# EAGLE design mapleSDuino-V0.1_020-eagle7 (EAGLE 7.6.0)
MAPLE-CUx Large Version
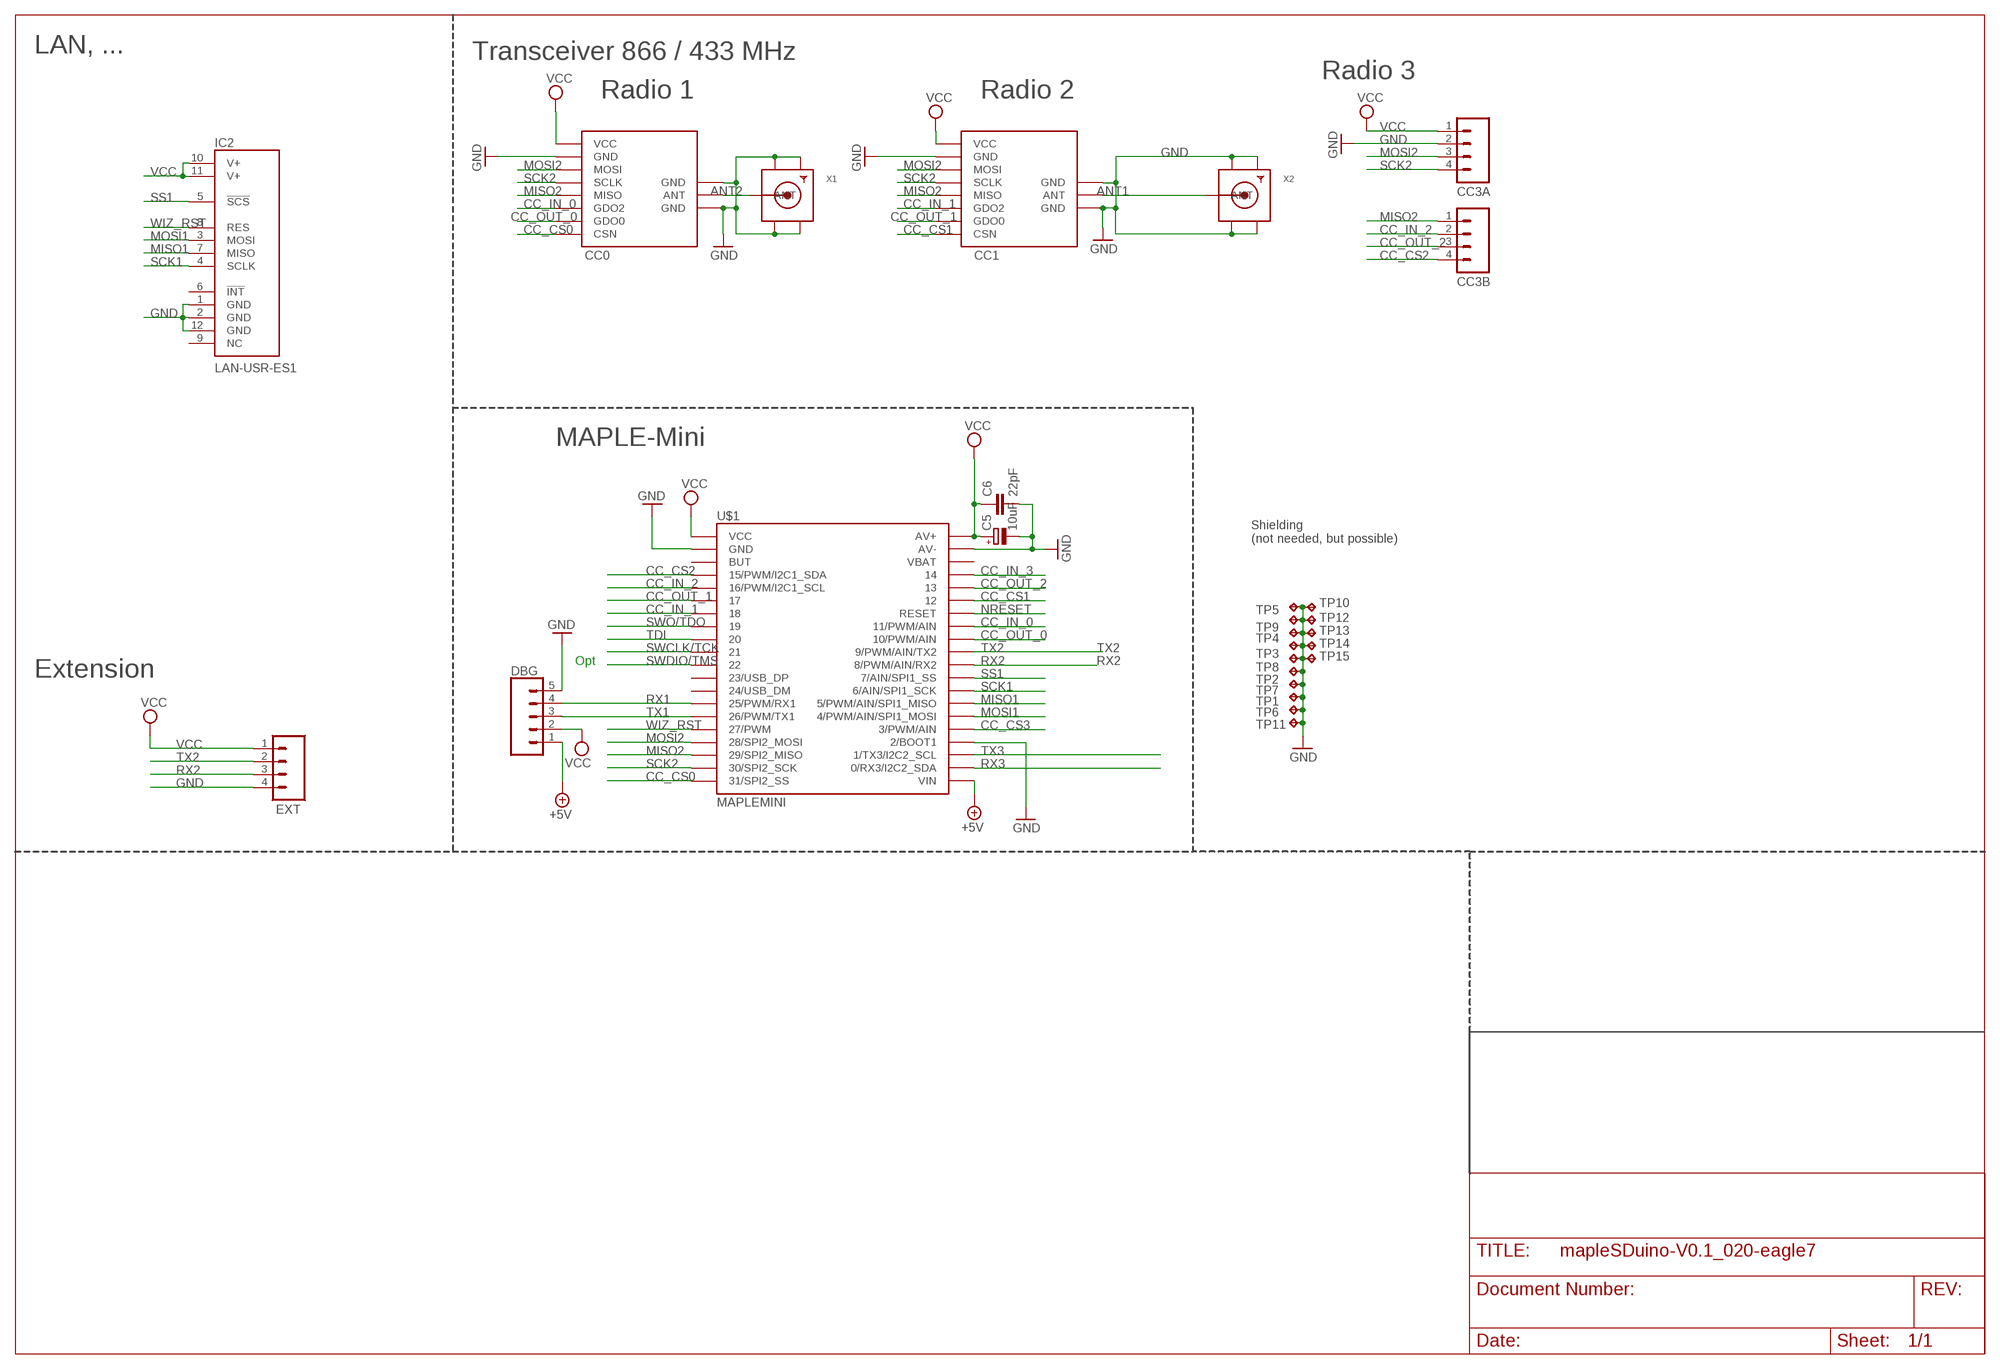
[diagram p0: schematic, sheet 1]

## Parts
C5  10uF  CPOL-EUR/2012-12W  [R/2012-12W]
C6  22pF  C-EUC0805  [C0805]
CC0  CC1101  CC1101_MODULE1SMD  [CC1101_MODULE1_SMD]
CC1  CC1101_MODULE1SMD  [CC1101_MODULE1_SMD]
CC3A  CONN_04PTH  [1X04]
CC3B  CONN_04PTH  [1X04]
DBG  CONN_05LOCK  [1X05_LOCK]
EXT  CONN_04PTH  [1X04]
IC2  LAN-USR-ES1  [USR-ES1]
TP1  TPTP06SQ  [TP06SQ]
TP2  TPTP06SQ  [TP06SQ]
TP3  TPTP06SQ  [TP06SQ]
TP4  TPTP06SQ  [TP06SQ]
TP5  TPTP06SQ  [TP06SQ]
TP6  TPTP06SQ  [TP06SQ]
TP7  TPTP06SQ  [TP06SQ]
TP8  TPTP06SQ  [TP06SQ]
TP9  TPTP06SQ  [TP06SQ]
TP10  TPTP06SQ  [TP06SQ]
TP11  TPTP06SQ  [TP06SQ]
TP12  TPTP06SQ  [TP06SQ]
TP13  TPTP06SQ  [TP06SQ]
TP14  TPTP06SQ  [TP06SQ]
TP15  TPTP06SQ  [TP06SQ]
U$1  MAPLEMINI  [20-DIP]
X1  SMACONNECTOR_EDGE  [SMA_EDGELAUNCH]
X2  SMACONNECTOR_EDGE  [SMA_EDGELAUNCH]

## Nets
+5V [PWR]: DBG.1 U$1.21(VIN)
ANT1 [PWR]: CC1.ANT X2.P(ANT)
ANT2: CC0.ANT X1.P(ANT)
CC_CS0: CC0.CSN U$1.20(31/SPI2_SS)
CC_CS1: CC1.CSN U$1.35
CC_CS2: CC3B.4 U$1.4(15/PWM/I2C1_SDA)
CC_CS3: U$1.25(3/PWM/AIN)
CC_IN_0: CC0.GDO2 U$1.33(11/PWM/AIN)
CC_IN_1: CC1.GDO2 U$1.7
CC_IN_2: CC3B.2 U$1.5(16/PWM/I2C1_SCL)
CC_IN_3: U$1.37
CC_OUT_0: CC0.GDO0 U$1.32(10/PWM/AIN)
CC_OUT_1: CC1.GDO0 U$1.6
CC_OUT_2: CC3B.3 U$1.36
GND [PWR]: C5.- C6.2 CC0.GND@0(GND) CC0.GND@1(GND) CC0.GND@2(GND) CC1.GND@0(GND) CC1.GND@1(GND) CC1.GND@2(GND) CC3A.2 DBG.5 EXT.4 IC2.1(GND) IC2.2(GND) IC2.12(GND) TP1.TP TP2.TP TP3.TP TP4.TP TP5.TP TP6.TP TP7.TP TP8.TP TP9.TP TP10.TP TP11.TP TP12.TP TP13.TP TP14.TP TP15.TP U$1.2(GND) U$1.24(2/BOOT1) U$1.39(AV-) X1.GND@1(GND4) X1.GND@2(GND3) X1.GND@3(GND2) X1.GND@4(GND1) X2.GND@1(GND4) X2.GND@2(GND3) X2.GND@3(GND2) X2.GND@4(GND1)
MISO1: IC2.7(MISO) U$1.27(5/PWM/AIN/SPI1_MISO)
MISO2: CC0.MISO CC1.MISO CC3B.1 U$1.18(29/SPI2_MISO)
MOSI1: IC2.3(MOSI) U$1.26(4/PWM/AIN/SPI1_MOSI)
MOSI2: CC0.MOSI CC1.MOSI CC3A.3 U$1.17(28/SPI2_MOSI)
NRESET: U$1.34(RESET)
RX1: DBG.4 U$1.14(25/PWM/RX1)
RX2: EXT.3 U$1.30(8/PWM/AIN/RX2)
RX3: U$1.22(0/RX3/I2C2_SDA)
SCK1: IC2.4(SCLK) U$1.28(6/AIN/SPI1_SCK)
SCK2: CC0.SCLK CC1.SCLK CC3A.4 U$1.19(30/SPI2_SCK)
SS1: IC2.5(!SCS!) U$1.29(7/AIN/SPI1_SS)
SWCLK/TCK: U$1.10
SWDIO/TMS: U$1.11
SWO/TDO: U$1.8
TDI: U$1.9
TX1: DBG.3 U$1.15(26/PWM/TX1)
TX2: EXT.2 U$1.31(9/PWM/AIN/TX2)
TX3: U$1.23(1/TX3/I2C2_SCL)
VCC [PWR]: C5.+ C6.1 CC0.VCC CC1.VCC CC3A.1 DBG.2 EXT.1 IC2.10(V+) IC2.11(V+) U$1.1(VCC) U$1.40(AV+)
WIZ_RST: IC2.8(RES) U$1.16(27/PWM)
Unconnected: IC2.6(!INT!) IC2.9(NC) U$1.3(BUT) U$1.12(23/USB_DP) U$1.13(24/USB_DM) U$1.38(VBAT)

## Notes on the sheet
- LAN, ... | Transceiver 866 / 433 MHz
- Radio 3
- Radio 1 | Radio 2
- MAPLE-Mini
- Shielding
  (not needed, but possible)
- Opt
- Extension

## Library data of the parts
C5 = rcl:CPOL-EU: POLARIZED CAPACITOR, European symbol
C6 = rcl:C-EU: CAPACITOR, European symbol
CC0 CC1 = wireless:CC1101_MODULE1: CC1101 wireless module for 433/868 MHz (sold from Aliexpress). DIL version for mounting with pin header (and SMD soldering) and SMD only variant available.
CC3A CC3B EXT = SparkFun-Connectors:CONN_04: Multi connection point. Often used as Generic Header-pin footprint for 0.1 inch spaced/style header connections On any of the 0.1 inch spaced packages, you can populate with these: Break Away Headers - Straight <https://www.sparkfun.com/products/116> (PRT-00116) Break Away Male Headers - Right Angle <https://www.sparkfun.com/products/553> (PRT-00553) Female Headers <https://www.sparkfun.com/products/115> (PRT-00115) Break Away Headers - Machine Pin <https://www.sparkfun.com/products/117> (PRT-00117) Break Away Female Headers - Swiss Machine Pin <https://www.sparkfun.com/products/743> (PRT-00743) For SCREWTERMINALS and SPRING TERMINALS visit here: Screw Terimnals on SparkFun.com <https://www.sparkfun.com/search/results?term=Screw+Terminals> (5mm/3.5mm/2.54mm spacing) This device is also useful as a general connection point to wire up your design to another part of your project. Our various solder wires solder well into these plated through hole pads. Hook-Up Wire - Assortment (Stranded, 22 AWG) <https://www.sparkfun.com/products/11375> (PRT-11375) Hook-Up Wire - Assortment (Solid Core, 22 AWG) <https://www.sparkfun.com/products/11367> (PRT-11367) View the entire wire category on our website here <https://www.sparkfun.com/categories/141> Special notes: Molex polarized connector foot print use with SKU : PRT-08231 with associated crimp pins and housings. 1MM SMD Version SKU: PRT-10208; PROD_ID: CONN-09696
DBG = SparkFun-Connectors:CONN_05: Multi connection point. Often used as Generic Header-pin footprint for 0.1 inch spaced/style header connections On any of the 0.1 inch spaced packages, you can populate with these: Break Away Headers - Straight <https://www.sparkfun.com/products/116> (PRT-00116) Break Away Male Headers - Right Angle <https://www.sparkfun.com/products/553> (PRT-00553) Female Headers <https://www.sparkfun.com/products/115> (PRT-00115) Break Away Headers - Machine Pin <https://www.sparkfun.com/products/117> (PRT-00117) Break Away Female Headers - Swiss Machine Pin <https://www.sparkfun.com/products/743> (PRT-00743) For SCREWTERMINALS and SPRING TERMINALS visit here: Screw Terimnals on SparkFun.com <https://www.sparkfun.com/search/results?term=Screw+Terminals> (5mm/3.5mm/2.54mm spacing) This device is also useful as a general connection point to wire up your design to another part of your project. Our various solder wires solder well into these plated through hole pads. Hook-Up Wire - Assortment (Stranded, 22 AWG) <https://www.sparkfun.com/products/11375> (PRT-11375) Hook-Up Wire - Assortment (Solid Core, 22 AWG) <https://www.sparkfun.com/products/11367> (PRT-11367) View the entire wire category on our website here <https://www.sparkfun.com/categories/141> Special notes: Molex polarized connector foot print use with SKU : PRT-08231 with associated crimp pins and housings. 1MM SMD Version SKU: PRT-10208
IC2 = Martin-Communication:LAN-USR-ES1
TP1-TP15 = testpad:TP: Test pad
U$1 = maplemini-small:MAPLEMINI
X1 X2 = adafruit:SMACONNECTOR: SMA Connector 90° DIP SMA Connector, 50 Ohm (4UConnector: 07259)

## Net classes
0 default: width 0.305 mm
1 PWR: width 0.406 mm

## Board
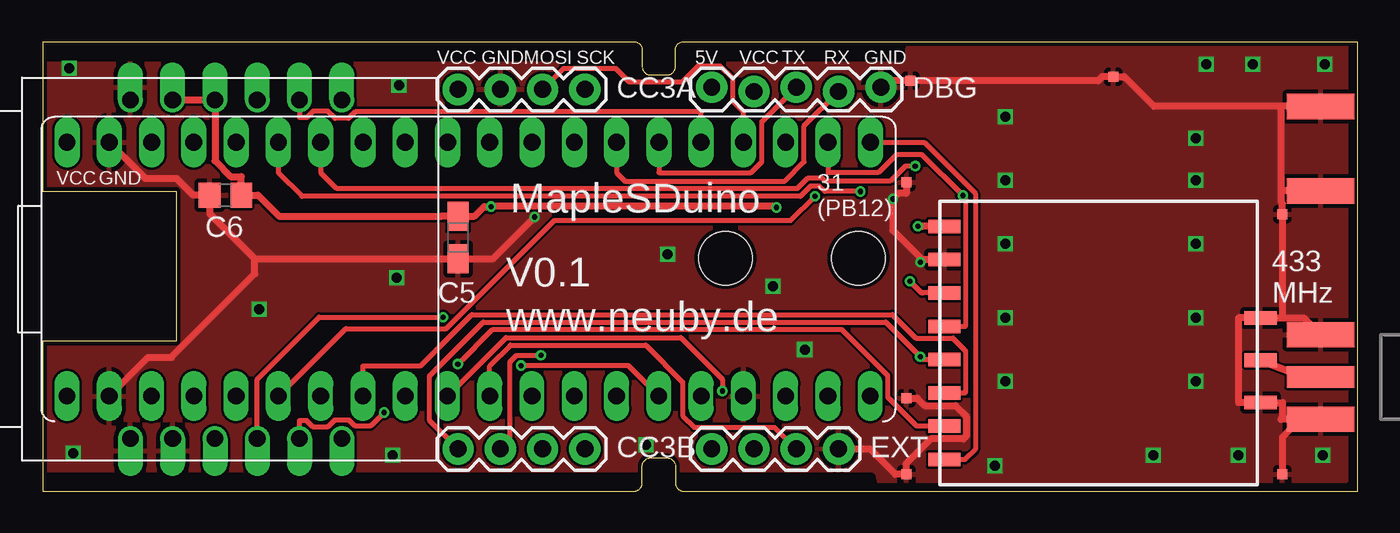
[diagram p1: board, top side]
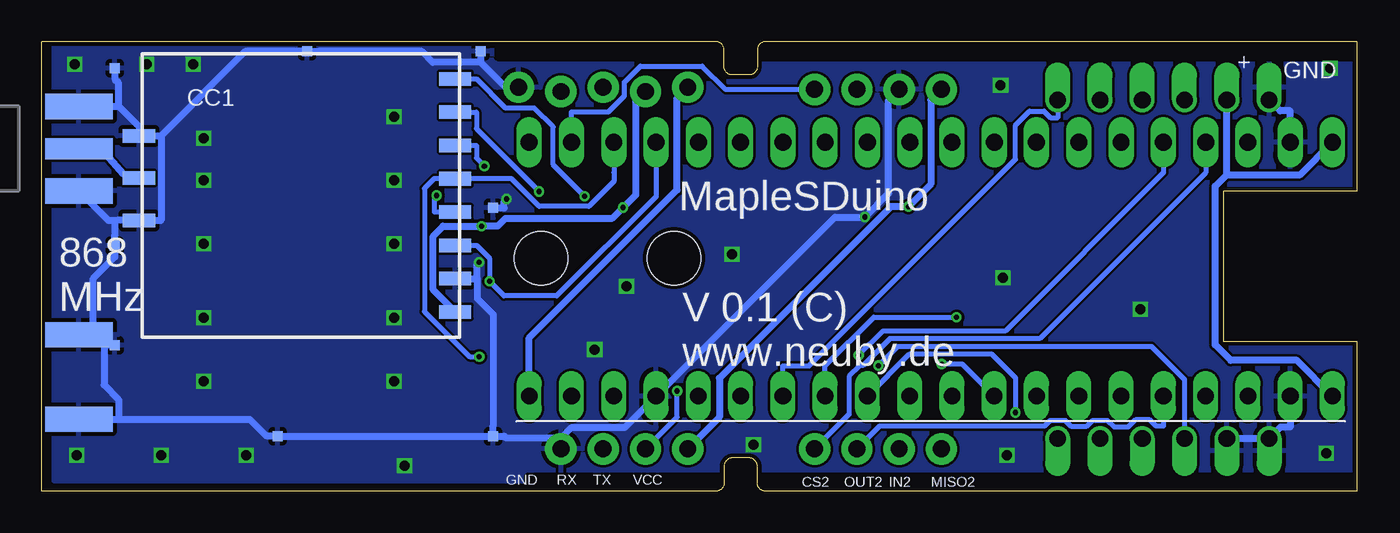
[diagram p2: board, bottom side, seen from below]

Size 79 x 27 mm. Coordinates in mm from the lower left corner, seen from the top.
Outline: 0,0 35.5,0 arc90 36,0.5 36,1.5 arc-90 36.5,2 37.5,2 arc-90 38,1.5 38,0.5 arc90 38.5,0 79,0 79,27 38.5,27 arc90 38,26.5 38,25.5 arc-90 37.5,25 36.5,25 arc-90 36,25.5 36,26.5 arc90 35.5,27 0,27 0,18 8,18 8,9 0,9 0,0
Copper layers (1*16): Top 0.035mm / dielectric 1.5mm / Bottom 0.035mm
Design rules "Fusion_eagle_rule_v1.1": minimum track width 6mil, minimum drill 12mil, track to track 6mil, track to pad 6mil, pad to pad 6mil, via to via 6mil, smd to smd 0mil, copper to edge 10mil, drill to drill 10mil, minimum pad ring 10mil, minimum via ring 6mil, stop-mask expansion 2mil, vias tented up to drill 100mil, thermal gap 10mil
Holes 3.2 mm at 49,14 41,14
tRestrict: 8 lines
bRestrict: 8 lines

### Footprints (pad centres in the part's own frame; a part is rotated, then mirrored left to right if it is on the bottom)
R/2012-12W = smd 1.75 x 1.26: + 1.275,0; - -1.275,0
C0805 = smd 1.3 x 1.5: 1 -0.95,0; 2 0.95,0
CC1101_MODULE1_SMD = smd 1.93 x 0.813: ANT 19,5.96; CSN 0,0; GDO0 0,2; GDO2 0,4; GND@0 0,12; GND@1 19,8.5; GND@2 19,3.42; MISO 0,6; MOSI 0,10; SCLK 0,8; VCC 0,14
1X04 = drill 1.016 pad 1.88: 1 0,0; 2 2.54,0; 3 5.08,0; 4 7.62,0
1X05_LOCK = drill 1.016 pad 1.88: 1 0,0.127; 2 2.54,-0.127; 3 5.08,0.127; 4 7.62,-0.127; 5 10.16,0.127
USR-ES1 = drill 1 pad 1.35 offset: 1 -10.16,5.715; 2 -10.16,3.175; 3 -10.16,0.635; 4 -10.16,-1.905; 5 -10.16,-4.445; 6 -10.16,-6.985; 7 10.16,-6.985; 8 10.16,-4.445; 9 10.16,-1.905; 10 10.16,0.635; 11 10.16,3.175; 12 10.16,5.715
TP06SQ = smd 0.6 x 0.6: TP 0,0
20-DIP = drill 1.016 pad 1.27 long: 1 -24.13,-7.62; 2 -21.59,-7.62; 3 -19.05,-7.62; 4 -16.51,-7.62; 5 -13.97,-7.62; 6 -11.43,-7.62; 7 -8.89,-7.62; 8 -6.35,-7.62; 9 -3.81,-7.62; 10 -1.27,-7.62; 11 1.27,-7.62; 12 3.81,-7.62; 13 6.35,-7.62; 14 8.89,-7.62; 15 11.43,-7.62; 16 13.97,-7.62; 17 16.51,-7.62; 18 19.05,-7.62; 19 21.59,-7.62; 20 24.13,-7.62 | drill 1 pad 1.27 long: 21 24.13,7.62; 22 21.59,7.62; 23 19.05,7.62; 24 16.51,7.62; 25 13.97,7.62; 26 11.43,7.62; 27 8.89,7.62; 28 6.35,7.62; 29 3.81,7.62; 30 1.27,7.62; 31 -1.27,7.62; 32 -3.81,7.62; 33 -6.35,7.62; 34 -8.89,7.62; 35 -11.43,7.62; 36 -13.97,7.62; 37 -16.51,7.62; 38 -19.05,7.62; 39 -21.59,7.62; 40 -24.13,7.62
SMA_EDGELAUNCH = smd 4.064 x 1.524: GND@1 2.032,-2.54; GND@2 2.032,2.54 | smd 4.064 x 1.524 bottom: GND@3 2.032,2.54; GND@4 2.032,-2.54 | smd 4.064 x 1.27: P 2.032,0

### Placement (x,y rotation side)
C5  24.94,15.24 90 top
C6  10.97,17.78 180 top
CC0  54.15,1.91 0 top
CC1  54.15,24.77 180 bottom
CC3A  24.94,24.13 0 top
CC3B  24.94,2.54 0 top
DBG  40.18,24.13 0 top
EXT  40.18,2.54 0 top
IC2  10.97,13.34 90 top
TP1  51.86,1.02 0 top
TP2  51.86,5.59 0 top
TP3  51.86,18.54 90 top
TP4  74.47,1.02 90 top
TP5  74.47,16.64 90 top
TP6  51.86,3.3 90 bottom
TP7  74.6,25.4 90 bottom
TP8  74.6,8.76 90 bottom
TP9  63.04,26.42 90 bottom
TP10  74.6,14.73 90 bottom
TP11  51.86,17.02 90 bottom
TP12  52.12,24.64 0 top
TP13  64.31,24.89 0 top
TP14  64.82,3.3 0 bottom
TP15  52.63,26.42 0 bottom
U$1  25.57,13.34 180 bottom
X1  78.79,6.86 180 top
X2  78.79,20.57 0 bottom

### Tracks (layer width: path | path; a pad name or v marks a point on that pad's centre or on a via)
+5V
  Bottom 0.406: U$1.21 49.7,9.2 40.81,18.09 40.81,23.62 DBG.1
ANT1
  Bottom 0.406: CC1.ANT 74.09,19.05 75.11,20.19 X2.P
ANT2
  Top 0.406: CC0.ANT 76.12,6.73 X1.P
CC_CS0
  Top 0.305: CC0.CSN 55.42,1.91 56.01,2.5 56.01,17.89 52.95,20.95 U$1.20
CC_CS1  (via drill 0.3 pad 0.61)
  Top 0.305: U$1.35 18.19,9.76 24.23,9.76 30.73,16.26 44.92,16.26 | 44.92,16.26 | 44.92,16.26 v46.38,17.72
  Bottom 0.305: CC1.CSN 52.88,24.77 51.13,23.01 49.41,23.01 48.27,21.88 48.27,19.61 v46.38,17.72
CC_CS2
  Bottom 0.305: CC3B.4 30.49,4.61 30.49,6.89 29.84,7.55 29.66,7.55 28.05,9.16 19.03,9.16 9.06,19.13 U$1.4
CC_IN_0
  Top 0.305: CC0.GDO2 55.42,5.91 55.42,8.45 54.67,9.19 52.45,9.19 51.04,10.61 25.77,10.61 22.69,7.53 19.23,7.53 U$1.33
CC_IN_1  (via drill 0.3 pad 0.61)
  Top 0.305: v52.4,19.53 51.82,19.53 50.91,18.62 46.98,18.62 46.82,18.79 45.94,18.79 45.31,18.16 17.65,18.16 16.68,19.13 U$1.7
  Bottom 0.305: CC1.GDO2 52.88,20.77 52.88,20 v52.4,19.53
CC_IN_2  (via drill 0.3 pad 0.61)
  Top 0.305: CC3B.2 28.06,3.12 28.06,7.77 28.45,8.16 v29.91,8.16
  Bottom 0.305: v29.91,8.16 28.45,9.62 21.11,9.62 11.61,19.13 U$1.5
CC_OUT_0  (via drill 0.3 pad 0.61)
  Top 0.305: CC0.GDO0 52.5,3.9 50.76,5.64 50.76,6.94 48.02,9.69 26.98,9.69 v24.93,7.63
  Bottom 0.305: U$1.32 23.68,7.63 v24.93,7.63
CC_OUT_1  (via drill 0.3 pad 0.61)
  Top 0.305: v49.11,18 46.96,18 46.63,18.33 46.13,18.33 45.5,17.71 15.56,17.71 14.14,19.13 U$1.6
  Bottom 0.305: v49.11,18 52.88,21.77 52.88,22.77 CC1.GDO0
CC_OUT_2
  Bottom 0.305: U$1.36 11.61,3.9 12.04,3.9 12.43,4.29 13.29,4.29 13.73,3.85 14.56,3.85 14.96,4.25 15.87,4.25 16.24,3.88 17.13,3.88 17.49,4.24 18.42,4.24 18.76,3.9 28.66,3.9 CC3B.3
GND  (via drill 0.3 pad 0.61, 0.6)
  Top 0.406: v29.54,16.47 27.04,13.96 C5.- 12.73,13.96 | v52.71,13.76 52.83,13.87 52.83,13.9 | 52.83,13.9 51.07,15.67 v51.07,17.55 51.4,17.89 51.86,17.89 TP3.TP | CC0.GND@0 52.83,13.9 | 74.37,23.11 66.74,23.11 64.97,24.89 TP13.TP 63.65,24.89 63.4,24.64 TP12.TP 50.72,24.64 DBG.5 | 74.37,23.11 75.56,23.11 X2.GND@2 | 74.37,23.11 74.37,18.03 | X2.GND@1 74.37,18.03 | 74.37,18.03 74.37,17.39 74.47,17.29 TP5.TP 74.47,15.98 74.47,10.4 | 74.47,10.4 75.75,10.4 X1.GND@1 | 74.47,10.4 CC0.GND@1 71.83,10.4 71.83,5.33 CC0.GND@2 74.47,5.33 74.47,4.42 74.37,4.32 75.56,4.32 | 12.73,13.96 10.02,16.67 C6.2 9.01,17.78 8.01,18.79 6.15,18.79 U$1.2 | U$1.39 6.31,8.04 7.72,8.04 12.73,13.06 12.73,13.96 | 75.56,4.32 74.47,3.23 TP4.TP | X1.GND@2 75.56,4.32 | TP2.TP 52.52,5.59 52.97,5.14 54.83,5.14 55.47,4.5 55.47,3.31 55.3,3.14 53.34,3.14 51.86,1.67 TP1.TP 51.21,1.02 49.68,2.54 EXT.4
  Bottom 0.406: CC3A.2 28.11,23.5 28.11,17.89 v29.54,16.47 31.33,16.47 U$1.24 43.96,3.84 47.15,3.84 47.8,3.19 | 52.85,12.77 52.85,13.62 v52.71,13.76 | 52.85,12.77 52.83,12.77 52.83,11.59 51.86,10.62 51.86,3.96 TP6.TP | 52.85,12.77 52.86,12.77 52.97,12.77 CC1.GND@0 | TP11.TP 51.21,17.02 51.21,17.41 v51.07,17.55 | 74.37,4.32 66.49,4.32 65.47,3.3 TP14.TP TP6.TP | 75.25,8.76 75.25,6.39 74.37,5.5 74.37,4.32 | 47.8,3.19 51.09,3.19 51.21,3.3 TP6.TP | EXT.4 47.8,3.19 | 75.89,9.4 75.25,8.76 | X1.GND@2 74.37,4.32 | 52.63,25.76 55.5,25.76 56.15,26.42 62.39,26.42 TP9.TP 66.76,26.42 71.83,21.34 | TP15.TP 52.63,25.76 | DBG.5 51.12,24.26 52.63,25.76 | 74.37,23.11 73.15,21.9 CC1.GND@2 71.83,21.34 | 71.83,21.34 71.83,16.27 CC1.GND@1 74.47,16.27 74.6,16.27 | IC2.2 IC2.1 4.58,3.85 3.99,3.85 U$1.39 | X2.GND@2 74.51,23.11 74.37,23.11 | 74.37,23.11 | X1.GND@1 75.89,9.4 | 75.89,9.4 75.89,12.79 74.6,14.08 TP10.TP 74.6,15.39 74.6,16.27 | X2.GND@1 74.99,16.27 74.6,16.27 | U$1.2 3.99,22.84 4.59,22.84 IC2.12 | TP8.TP 75.25,8.76 | TP7.TP 74.6,24.74 74.37,24.52 74.37,23.11
  other vias: 13,10.92 1.83,2.29 1.57,25.4 21.38,24.38 77.01,25.65 72.69,25.65 69.9,25.65 76.88,2.16 71.8,2.16 66.72,2.16 57.2,1.52 36.24,2.79 43.86,12.32 37.51,14.22 57.83,22.48 57.83,18.67 57.83,14.86 57.83,10.41 57.83,6.6 69.26,6.6 69.26,10.41 69.26,14.86 69.26,18.67 69.26,21.21 45.77,8.51 21,2.16 21.26,12.83
  pour Top: 0.17,26.67 78.28,26.67 78.28,0.64 0.17,0.64
  pour Bottom: 0.17,26.67 78.28,26.67 78.28,0.64 0.17,0.64
MISO1
  Bottom 0.305: IC2.7 17.95,22.44 18.39,22.44 18.78,22.82 19.66,22.82 20.5,21.98 20.5,19.92 32.89,7.53 34.47,7.53 U$1.27
MISO2  (via drill 0.3 pad 0.61)
  Top 0.305: CC3B.1 23.24,4.24 23.24,6.94 26.45,10.15 50.63,10.15 v52.71,8.08 52.88,7.91 CC0.MISO
  Bottom 0.305: U$1.18 44.62,19.13 44.62,18.61 46.13,17.11 49.11,17.11 50.77,18.77 CC1.MISO 55.42,18.77 56,18.19 56,10.78 53.29,8.08 v52.71,8.08
MOSI1  (via drill 0.3 pad 0.61)
  Top 0.305: U$1.26 35.17,7.55 v28.72,7.55
  Bottom 0.305: v28.72,7.55 27.57,8.7 12.32,8.7 10.34,6.71 IC2.3
MOSI2  (via drill 0.3 pad 0.61)
  Top 0.305: U$1.17 42.09,22.78 41.45,23.42 41.45,24.78 40.69,25.54 39.35,25.54 38.38,24.57 35.24,24.57 34.43,25.38 31.27,25.38 CC3A.3 | v52.09,12.6 52.79,11.9 52.88,11.9 CC0.MOSI
  Bottom 0.305: U$1.17 42.09,19.13 42.09,17.7 48.05,11.73 51.22,11.73 v52.09,12.6 52.09,14 52.86,14.77 52.88,14.77 CC1.MOSI
RX1
  Top 0.305: U$1.14 34.47,19.13 34.97,18.62 44.57,18.62 45.73,19.78 45.73,21.94 DBG.4
RX2
  Top 0.305: EXT.3 43.97,3.84 39.14,3.84 38.44,4.54 38.44,6.55 36.22,8.77 28.08,8.77 26.84,7.53 U$1.30
SCK1  (via drill 0.3 pad 0.61)
  Top 0.305: IC2.4 12.88,6.73 16.59,10.45 v24.03,10.45
  Bottom 0.305: v24.03,10.45 29,10.45 31.92,7.53 U$1.28
SCK2  (via drill 0.3 pad 0.61)
  Top 0.305: U$1.19 47.16,19.13 50.19,19.13 51.27,20.2 52.82,20.2 v55.26,17.76 55.42,17.6 55.42,9.9 CC0.SCLK
  Bottom 0.305: U$1.19 47.16,22.78 44.95,22.78 43.99,23.74 43.99,24.57 43.02,25.54 39.31,25.54 37.91,24.13 CC3A.4 | CC1.SCLK 55.42,16.77 55.42,17.6 v55.26,17.76
SS1  (via drill 0.3 pad 0.61)
  Top 0.305: v20.5,4.72 19.67,3.9 18.76,3.9 18.4,4.26 17.51,4.26 17.1,3.85 16.24,3.85 15.85,4.23 15.41,4.23 IC2.5
  Bottom 0.305: U$1.29 26.86,8.24 21.94,8.24 20.5,6.8 v20.5,4.72
TX1
  Top 0.305: U$1.15 37.01,19.13 42.54,19.13 43.19,19.78 43.19,22.19 DBG.3
TX2  (via drill 0.3 pad 0.61)
  Top 0.305: U$1.31 27.81,9.22 38.32,9.22 40.81,6.73 v40.81,6.02
  Bottom 0.305: EXT.2 40.81,4.45 v40.81,6.02
VCC  (via drill 0.3 pad 0.61)
  Top 0.406: v44.07,17.04 43.98,17.13 26.95,17.13 v26.92,17.1 26.51,17.1 25.93,16.52 25.43,16.52 C5.+ 23.95,16.52 14.19,16.52 12.93,17.78 C6.1 11.92,18.89 11.29,18.89 10.34,19.84 IC2.10 IC2.11 | CC0.VCC 52.83,15.9 52.82,15.91 v52.56,15.91
  Bottom 0.406: 38.27,6.8 27.98,17.1 v26.92,17.1 25.57,18.44 25.57,23.5 CC3A.1 | 38.27,6.8 | 38.27,6.8 38.27,4.45 EXT.1 | CC1.VCC 55.47,12.09 55.47,15.33 54.88,15.91 v52.56,15.91 51.61,15.91 51.15,16.37 44.74,16.37 v44.07,17.04 43.32,17.79 43.32,23.4 DBG.2 | 7.79,19.02 IC2.11 | U$1.40 3.59,7.86 7.56,7.86 8.49,8.79 8.49,18.33 7.79,19.02 | 7.79,19.02 3.38,19.02 U$1.1
WIZ_RST
  Top 0.305: IC2.8 15.41,22.44 15.85,22.44 16.24,22.82 17.11,22.82 17.55,22.39 18.36,22.39 18.76,22.78 39.55,22.78 U$1.16

### Text on the board
tNames: VCC | GND | MOSI | SCK | 5V | VCC | TX | RX | GND | 31 / (PB12) | VCC | GND | MapleSDuino | 433 / MHz | V0.1 / www.neuby.de
bNames: + | GND | CC1 | MapleSDuino | 868 / MHz | V 0.1 (C) / www.neuby.de | MISO2 | IN2 | OUT2 | CS2 | VCC | TX | RX | GND